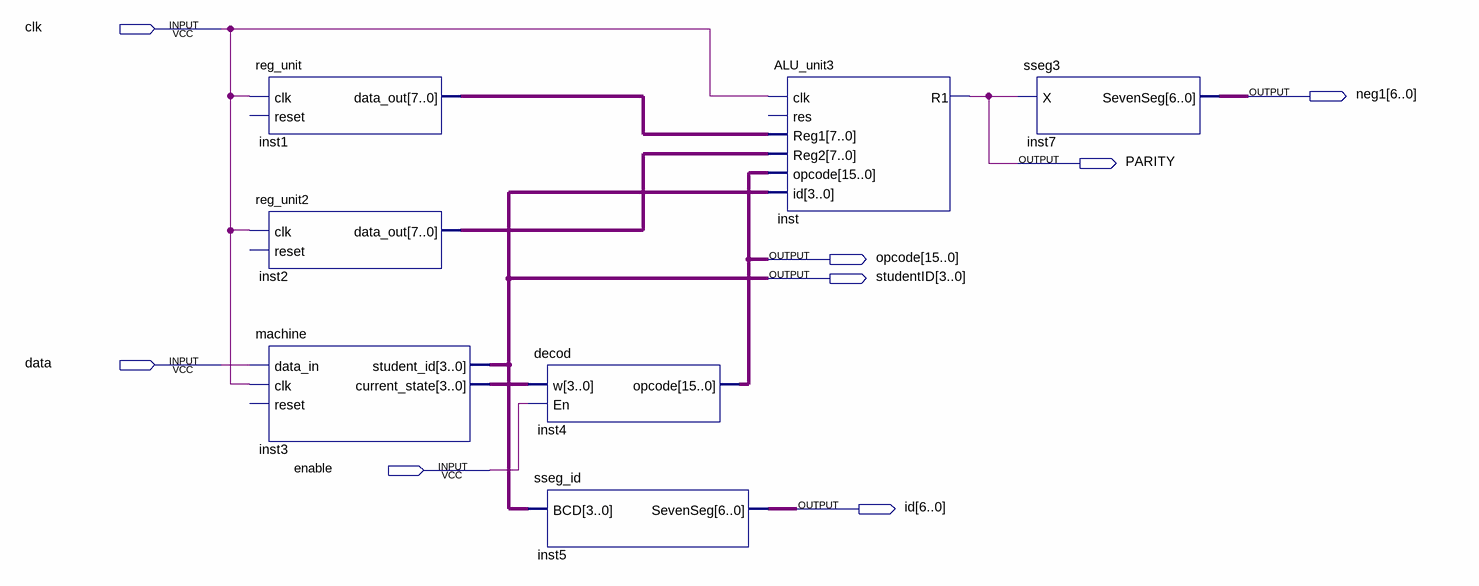
[diagram p0: schematic sheet]
// Quartus schematic PROBLEM_3.bdf as structural Verilog: 7 symbols, 8 pins
module PROBLEM_3 (
  input  clk,
  input  data,
  input  enable,
  output [6:0] neg1,
  output PARITY,
  output [15:0] opcode,
  output [3:0] studentID,
  output [6:0] id
);

  wire [3:0] inst3_current_state;
  wire [7:0] inst1_data_out, inst2_data_out;

  reg_unit inst1 (.clk(clk), .data_out(inst1_data_out));  // open: reset
  reg_unit2 inst2 (.clk(clk), .data_out(inst2_data_out));  // open: reset
  machine inst3 (
    .data_in(data), .clk(clk), .student_id(studentID), .current_state(inst3_current_state));  // open: reset
  decod inst4 (.w(inst3_current_state), .En(enable), .opcode(opcode));
  sseg_id inst5 (.BCD(studentID), .SevenSeg(id));
  ALU_unit3 inst (
    .clk(clk), .Reg1(inst1_data_out), .Reg2(inst2_data_out), .opcode(opcode), .id(studentID), .R1(PARITY));  // open: res
  sseg3 inst7 (.X(PARITY), .SevenSeg(neg1));
endmodule
